# EAGLE design PCE_Joypad_Breakout-v3 (EAGLE 9.4.0)
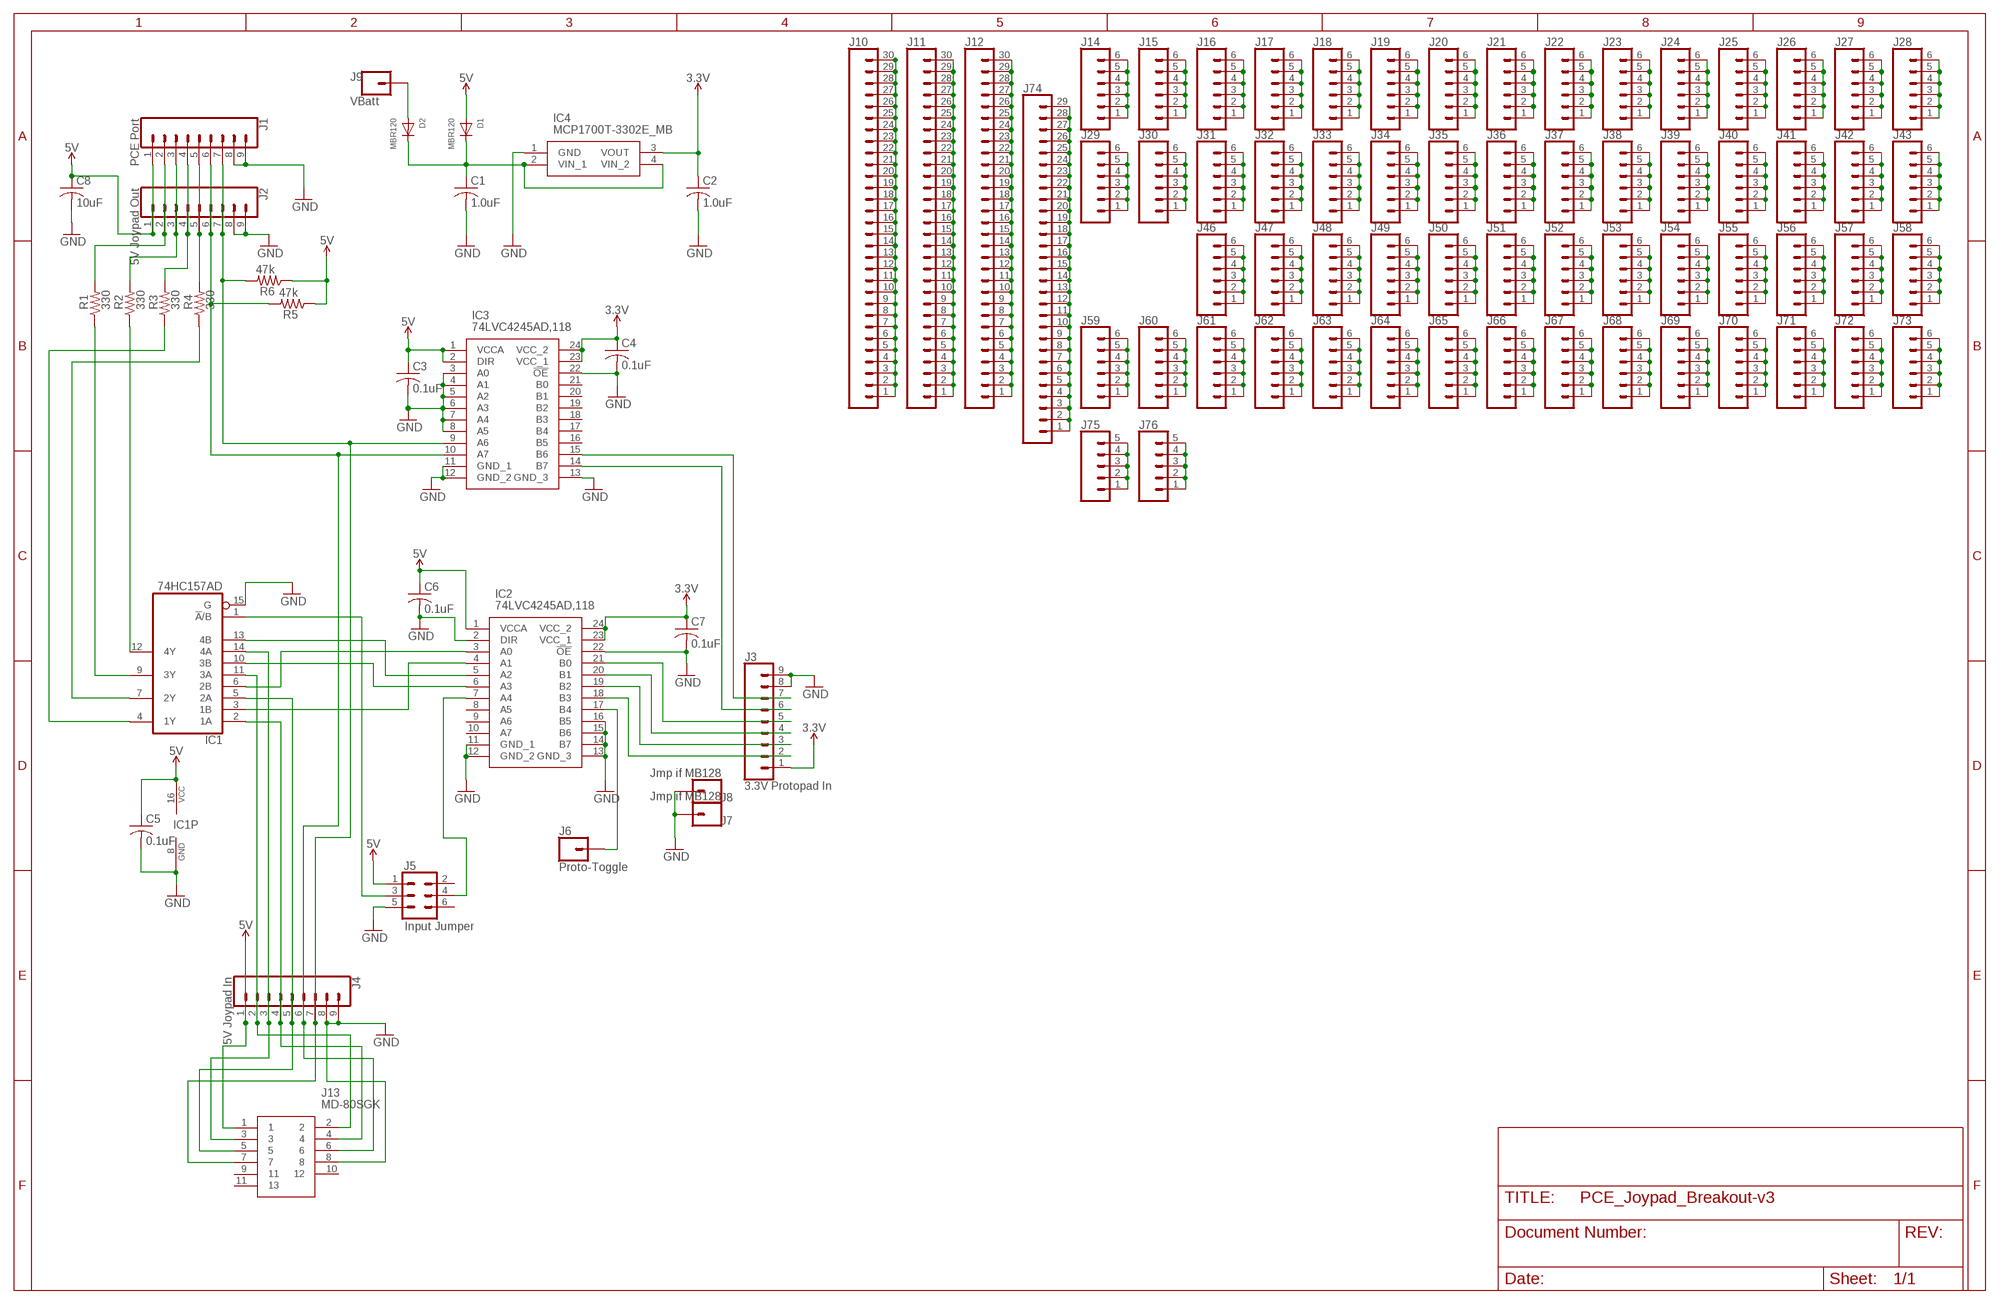
[diagram p0: schematic, sheet 1]

## Parts
C1  1.0uF  C-USC0805  [C0805]
C2  1.0uF  C-USC0805  [C0805]
C3  0.1uF  C-USC0805  [C0805]
C4  0.1uF  C-USC0805  [C0805]
C5  0.1uF  C-USC0805  [C0805]
C6  0.1uF  C-USC0805  [C0805]
C7  0.1uF  C-USC0805  [C0805]
C8  10uF  C-USC0805  [C0805]
D1  MBR120  DIODESOD-123  [SOD-123]
D2  MBR120  DIODESOD-123  [SOD-123]
IC1  74HC157AD  74157D  [SO16]
IC2  74LVC4245AD,118  [SOIC127P1032X265-24N]
IC3  74LVC4245AD,118  [SOIC127P1032X265-24N]
IC4  MCP1700T-3302E_MB  [MCP1700T-3302E/MB]
J1  PCE Port  CONN_09  [1X09]
J2  5V Joypad Out  CONN_09  [1X09]
J3  3.3V Protopad In  CONN_09  [1X09]
J4  5V Joypad In  CONN_09  [1X09]
J5  Input Jumper  CONN_03X2FEMALE  [2X3]
J6  Proto-Toggle  CONN_01  [1X01]
J7  Jmp if MB128  CONN_01  [1X01]
J8  Jmp if MB128  CONN_01  [1X01]
J9  VBatt  CONN_01  [1X01]
J10  CONN_30NO_SILK  [1X30_NO_SILK]
J11  CONN_30NO_SILK  [1X30_NO_SILK]
J12  CONN_30NO_SILK  [1X30_NO_SILK]
J13  MD-80SGK  [MD80SGK]
J14  CONN_06NO_SILK_FEMALE_PTH  [1X06_NO_SILK]
J15  CONN_06NO_SILK_FEMALE_PTH  [1X06_NO_SILK]
J16  CONN_06NO_SILK_FEMALE_PTH  [1X06_NO_SILK]
J17  CONN_06NO_SILK_FEMALE_PTH  [1X06_NO_SILK]
J18  CONN_06NO_SILK_FEMALE_PTH  [1X06_NO_SILK]
J19  CONN_06NO_SILK_FEMALE_PTH  [1X06_NO_SILK]
J20  CONN_06NO_SILK_FEMALE_PTH  [1X06_NO_SILK]
J21  CONN_06NO_SILK_FEMALE_PTH  [1X06_NO_SILK]
J22  CONN_06NO_SILK_FEMALE_PTH  [1X06_NO_SILK]
J23  CONN_06NO_SILK_FEMALE_PTH  [1X06_NO_SILK]
J24  CONN_06NO_SILK_FEMALE_PTH  [1X06_NO_SILK]
J25  CONN_06NO_SILK_FEMALE_PTH  [1X06_NO_SILK]
J26  CONN_06NO_SILK_FEMALE_PTH  [1X06_NO_SILK]
J27  CONN_06NO_SILK_FEMALE_PTH  [1X06_NO_SILK]
J28  CONN_06NO_SILK_FEMALE_PTH  [1X06_NO_SILK]
J29  CONN_06NO_SILK_FEMALE_PTH  [1X06_NO_SILK]
J30  CONN_06NO_SILK_FEMALE_PTH  [1X06_NO_SILK]
J31  CONN_06NO_SILK_FEMALE_PTH  [1X06_NO_SILK]
J32  CONN_06NO_SILK_FEMALE_PTH  [1X06_NO_SILK]
J33  CONN_06NO_SILK_FEMALE_PTH  [1X06_NO_SILK]
J34  CONN_06NO_SILK_FEMALE_PTH  [1X06_NO_SILK]
J35  CONN_06NO_SILK_FEMALE_PTH  [1X06_NO_SILK]
J36  CONN_06NO_SILK_FEMALE_PTH  [1X06_NO_SILK]
J37  CONN_06NO_SILK_FEMALE_PTH  [1X06_NO_SILK]
J38  CONN_06NO_SILK_FEMALE_PTH  [1X06_NO_SILK]
J39  CONN_06NO_SILK_FEMALE_PTH  [1X06_NO_SILK]
J40  CONN_06NO_SILK_FEMALE_PTH  [1X06_NO_SILK]
J41  CONN_06NO_SILK_FEMALE_PTH  [1X06_NO_SILK]
J42  CONN_06NO_SILK_FEMALE_PTH  [1X06_NO_SILK]
J43  CONN_06NO_SILK_FEMALE_PTH  [1X06_NO_SILK]
J46  CONN_06NO_SILK_FEMALE_PTH  [1X06_NO_SILK]
J47  CONN_06NO_SILK_FEMALE_PTH  [1X06_NO_SILK]
J48  CONN_06NO_SILK_FEMALE_PTH  [1X06_NO_SILK]
J49  CONN_06NO_SILK_FEMALE_PTH  [1X06_NO_SILK]
J50  CONN_06NO_SILK_FEMALE_PTH  [1X06_NO_SILK]
J51  CONN_06NO_SILK_FEMALE_PTH  [1X06_NO_SILK]
J52  CONN_06NO_SILK_FEMALE_PTH  [1X06_NO_SILK]
J53  CONN_06NO_SILK_FEMALE_PTH  [1X06_NO_SILK]
J54  CONN_06NO_SILK_FEMALE_PTH  [1X06_NO_SILK]
J55  CONN_06NO_SILK_FEMALE_PTH  [1X06_NO_SILK]
J56  CONN_06NO_SILK_FEMALE_PTH  [1X06_NO_SILK]
J57  CONN_06NO_SILK_FEMALE_PTH  [1X06_NO_SILK]
J58  CONN_06NO_SILK_FEMALE_PTH  [1X06_NO_SILK]
J59  CONN_06NO_SILK_FEMALE_PTH  [1X06_NO_SILK]
J60  CONN_06NO_SILK_FEMALE_PTH  [1X06_NO_SILK]
J61  CONN_06NO_SILK_FEMALE_PTH  [1X06_NO_SILK]
J62  CONN_06NO_SILK_FEMALE_PTH  [1X06_NO_SILK]
J63  CONN_06NO_SILK_FEMALE_PTH  [1X06_NO_SILK]
J64  CONN_06NO_SILK_FEMALE_PTH  [1X06_NO_SILK]
J65  CONN_06NO_SILK_FEMALE_PTH  [1X06_NO_SILK]
J66  CONN_06NO_SILK_FEMALE_PTH  [1X06_NO_SILK]
J67  CONN_06NO_SILK_FEMALE_PTH  [1X06_NO_SILK]
J68  CONN_06NO_SILK_FEMALE_PTH  [1X06_NO_SILK]
J69  CONN_06NO_SILK_FEMALE_PTH  [1X06_NO_SILK]
J70  CONN_06NO_SILK_FEMALE_PTH  [1X06_NO_SILK]
J71  CONN_06NO_SILK_FEMALE_PTH  [1X06_NO_SILK]
J72  CONN_06NO_SILK_FEMALE_PTH  [1X06_NO_SILK]
J73  CONN_06NO_SILK_FEMALE_PTH  [1X06_NO_SILK]
J74  CONN_29NO_SILK  [1X29_NO_SILK]
J75  CONN_05NO_SILK  [1X05_NO_SILK]
J76  CONN_05NO_SILK  [1X05_NO_SILK]
R1  330  R-US_R0805  [R0805]
R2  330  R-US_R0805  [R0805]
R3  330  R-US_R0805  [R0805]
R4  330  R-US_R0805  [R0805]
R5  47k  R-US_R0805  [R0805]
R6  47k  R-US_R0805  [R0805]

## Nets
3.3V [Power]: C2.1 C4.1 C7.1 IC2.23(VCC_1) IC2.24(VCC_2) IC3.23(VCC_1) IC3.24(VCC_2) IC4.3(VOUT) J3.1
5V [Power]: C3.1 C5.1 C6.1 C8.1 D1.A IC1.16(VCC) IC2.1(VCCA) IC3.1(VCCA) IC3.2(DIR) J1.1 J2.1 J4.1 J5.1 J13.1 R5.1 R6.1
GND [Power]: C1.2 C2.2 C3.2 C4.2 C5.2 C6.2 C7.2 C8.2 IC1.8(GND) IC1.15(G) IC2.2(DIR) IC2.11(GND_1) IC2.12(GND_2) IC2.13(GND_3) IC2.14(B7) IC2.15(B6) IC2.16(B5) IC2.22(!OE) IC3.3(A0) IC3.4(A1) IC3.5(A2) IC3.6(A3) IC3.7(A4) IC3.8(A5) IC3.11(GND_1) IC3.12(GND_2) IC3.13(GND_3) IC3.22(!OE) IC4.1(GND) J1.8 J1.9 J2.8 J2.9 J3.8 J3.9 J4.8 J4.9 J5.5 J7.1 J8.1 J13.8
N$1: J1.4 J2.4 R3.2
N$3 [Power]: C1.1 D1.C D2.C IC4.2(VIN_1) IC4.4(VIN_2)
N$4: J1.2 J2.2 R1.2
N$5: J1.3 J2.3 R2.2
N$6: IC1.11(3A) J4.2 J13.2
N$7: J1.5 J2.5 R4.2
N$8: IC1.9(3Y) R1.1
N$9: IC3.9(A6) J1.7 J2.7 J4.7 J13.7 R6.2
N$10: IC1.14(4A) J4.3 J13.3
N$11: IC1.2(1A) J4.4 J13.4
N$12: IC1.5(2A) J4.5 J13.5
N$13: IC3.14(B7) J3.6
N$14: IC3.15(B6) J3.7
N$15: IC1.6(2B) IC2.3(A0)
N$16: IC1.13(4B) IC2.5(A2)
N$17: IC1.10(3B) IC2.6(A3)
N$18: IC3.10(A7) J1.6 J2.6 J4.6 J13.6 R5.2
N$19: IC1.3(1B) IC2.4(A1)
N$20: IC1.4(1Y) R3.1
N$21: IC1.7(2Y) R4.1
N$22: IC2.21(B0) J3.5
N$23: IC2.20(B1) J3.4
N$24: IC2.19(B2) J3.3
N$25: IC1.1(!A!/B) J5.3
N$27: IC2.7(A4) J5.4
N$28 [Power]: D2.A J9.1
N$29: IC2.17(B4) J6.1
N$30 [Breadboard]: J10.1 J10.2 J10.3 J10.4 J10.5 J10.6 J10.7 J10.8 J10.9 J10.10 J10.11 J10.12 J10.13 J10.14 J10.15 J10.16 J10.17 J10.18 J10.19 J10.20 J10.21 J10.22 J10.23 J10.24 J10.25 J10.26 J10.27 J10.28 J10.29 J10.30
N$31 [Breadboard]: J11.1 J11.2 J11.3 J11.4 J11.5 J11.6 J11.7 J11.8 J11.9 J11.10 J11.11 J11.12 J11.13 J11.14 J11.15 J11.16 J11.17 J11.18 J11.19 J11.20 J11.21 J11.22 J11.23 J11.24 J11.25 J11.26 J11.27 J11.28 J11.29 J11.30
N$32 [Breadboard]: J12.1 J12.2 J12.3 J12.4 J12.5 J12.6 J12.7 J12.8 J12.9 J12.10 J12.11 J12.12 J12.13 J12.14 J12.15 J12.16 J12.17 J12.18 J12.19 J12.20 J12.21 J12.22 J12.23 J12.24 J12.25 J12.26 J12.27 J12.28 J12.29 J12.30
N$33: IC1.12(4Y) R2.1
N$34 [Breadboard]: J14.1 J14.2 J14.3 J14.4 J14.5 J14.6
N$35 [Breadboard]: J29.1 J29.2 J29.3 J29.4 J29.5 J29.6
N$36 [Breadboard]: J15.1 J15.2 J15.3 J15.4 J15.5 J15.6
N$37 [Breadboard]: J30.1 J30.2 J30.3 J30.4 J30.5 J30.6
N$38 [Breadboard]: J31.1 J31.2 J31.3 J31.4 J31.5 J31.6
N$39 [Breadboard]: J16.1 J16.2 J16.3 J16.4 J16.5 J16.6
N$40 [Breadboard]: J17.1 J17.2 J17.3 J17.4 J17.5 J17.6
N$41 [Breadboard]: J32.1 J32.2 J32.3 J32.4 J32.5 J32.6
N$42 [Breadboard]: J33.1 J33.2 J33.3 J33.4 J33.5 J33.6
N$43 [Breadboard]: J18.1 J18.2 J18.3 J18.4 J18.5 J18.6
N$44 [Breadboard]: J19.1 J19.2 J19.3 J19.4 J19.5 J19.6
N$45 [Breadboard]: J20.1 J20.2 J20.3 J20.4 J20.5 J20.6
N$46 [Breadboard]: J21.1 J21.2 J21.3 J21.4 J21.5 J21.6
N$47 [Breadboard]: J22.1 J22.2 J22.3 J22.4 J22.5 J22.6
N$48 [Breadboard]: J23.1 J23.2 J23.3 J23.4 J23.5 J23.6
N$49 [Breadboard]: J24.1 J24.2 J24.3 J24.4 J24.5 J24.6
N$50 [Breadboard]: J25.1 J25.2 J25.3 J25.4 J25.5 J25.6
N$51 [Breadboard]: J26.1 J26.2 J26.3 J26.4 J26.5 J26.6
N$52 [Breadboard]: J27.1 J27.2 J27.3 J27.4 J27.5 J27.6
N$53 [Breadboard]: J28.1 J28.2 J28.3 J28.4 J28.5 J28.6
N$54 [Breadboard]: J34.1 J34.2 J34.3 J34.4 J34.5 J34.6
N$55 [Breadboard]: J35.1 J35.2 J35.3 J35.4 J35.5 J35.6
N$56 [Breadboard]: J36.1 J36.2 J36.3 J36.4 J36.5 J36.6
N$57 [Breadboard]: J37.1 J37.2 J37.3 J37.4 J37.5 J37.6
N$58 [Breadboard]: J38.1 J38.2 J38.3 J38.4 J38.5 J38.6
N$59 [Breadboard]: J39.1 J39.2 J39.3 J39.4 J39.5 J39.6
N$60 [Breadboard]: J40.1 J40.2 J40.3 J40.4 J40.5 J40.6
N$61 [Breadboard]: J41.1 J41.2 J41.3 J41.4 J41.5 J41.6
N$62 [Breadboard]: J42.1 J42.2 J42.3 J42.4 J42.5 J42.6
N$63 [Breadboard]: J43.1 J43.2 J43.3 J43.4 J43.5 J43.6
N$64 [Breadboard]: J75.1 J75.2 J75.3 J75.4 J75.5
N$65 [Breadboard]: J76.1 J76.2 J76.3 J76.4 J76.5
N$66 [Breadboard]: J46.1 J46.2 J46.3 J46.4 J46.5 J46.6
N$67 [Breadboard]: J47.1 J47.2 J47.3 J47.4 J47.5 J47.6
N$68 [Breadboard]: J48.1 J48.2 J48.3 J48.4 J48.5 J48.6
N$69 [Breadboard]: J49.1 J49.2 J49.3 J49.4 J49.5 J49.6
N$70 [Breadboard]: J50.1 J50.2 J50.3 J50.4 J50.5 J50.6
N$71 [Breadboard]: J51.1 J51.2 J51.3 J51.4 J51.5 J51.6
N$72 [Breadboard]: J52.1 J52.2 J52.3 J52.4 J52.5 J52.6
N$73 [Breadboard]: J53.1 J53.2 J53.3 J53.4 J53.5 J53.6
N$74 [Breadboard]: J54.1 J54.2 J54.3 J54.4 J54.5 J54.6
N$75 [Breadboard]: J55.1 J55.2 J55.3 J55.4 J55.5 J55.6
N$76 [Breadboard]: J56.1 J56.2 J56.3 J56.4 J56.5 J56.6
N$77 [Breadboard]: J57.1 J57.2 J57.3 J57.4 J57.5 J57.6
N$78 [Breadboard]: J58.1 J58.2 J58.3 J58.4 J58.5 J58.6
N$79 [Breadboard]: J59.1 J59.2 J59.3 J59.4 J59.5 J59.6
N$80 [Breadboard]: J60.1 J60.2 J60.3 J60.4 J60.5 J60.6
N$81 [Breadboard]: J61.1 J61.2 J61.3 J61.4 J61.5 J61.6
N$82 [Breadboard]: J62.1 J62.2 J62.3 J62.4 J62.5 J62.6
N$83 [Breadboard]: J63.1 J63.2 J63.3 J63.4 J63.5 J63.6
N$84 [Breadboard]: J64.1 J64.2 J64.3 J64.4 J64.5 J64.6
N$85 [Breadboard]: J65.1 J65.2 J65.3 J65.4 J65.5 J65.6
N$86 [Breadboard]: J66.1 J66.2 J66.3 J66.4 J66.5 J66.6
N$87 [Breadboard]: J67.1 J67.2 J67.3 J67.4 J67.5 J67.6
N$88 [Breadboard]: J68.1 J68.2 J68.3 J68.4 J68.5 J68.6
N$89 [Breadboard]: J69.1 J69.2 J69.3 J69.4 J69.5 J69.6
N$90 [Breadboard]: J70.1 J70.2 J70.3 J70.4 J70.5 J70.6
N$91 [Breadboard]: J71.1 J71.2 J71.3 J71.4 J71.5 J71.6
N$92 [Breadboard]: J72.1 J72.2 J72.3 J72.4 J72.5 J72.6
N$93 [Breadboard]: J73.1 J73.2 J73.3 J73.4 J73.5 J73.6
N$94 [Breadboard]: J74.1 J74.2 J74.3 J74.4 J74.5 J74.6 J74.7 J74.8 J74.9 J74.10 J74.11 J74.12 J74.13 J74.14 J74.15 J74.16 J74.17 J74.18 J74.19 J74.20 J74.21 J74.22 J74.23 J74.24 J74.25 J74.26 J74.27 J74.28 J74.29
N$97: IC2.18(B3) J3.2
Unconnected: IC2.8(A5) IC2.9(A6) IC2.10(A7) IC3.16(B5) IC3.17(B4) IC3.18(B3) IC3.19(B2) IC3.20(B1) IC3.21(B0) J5.2 J5.6 J13.9 J13.10 J13.11

## Library data of the parts
C1-C8 = resistor:C-US: CAPACITOR, American symbol
D1 D2 = adafruit:DIODE: Diode SMADIODE - SMA Surface Mount Package 20V 1A Schottky Diode Digikey: 641-1014-6-ND DO-1N4148 - Through Hole Small Current Diode SOD-123 20V 1 A (.5mV Vf) Schottky Diode - Digikey: MBRX120TPMSCT-ND SOD-323 10V 570mA (.38mV Vf, 3ns) Schottky Diode - Digikey: ZLLS410CT-ND SOD-523 30V 30mA Schottky Diode (RB751S-40TE61) - Digikey: RB751S-40TE61CT-ND SOT23-R/W - SOT23 Package (R = Solder Paste/Reflow Ovens, W = Hand-Soldering) BAT54Film 40V 300mA - Digikey: 497-7162-1-ND
IC1 = 74xx-us:74*157: Quadruple 2-line to 1-line data SELECTOR/MULTIPLEXER
IC2 IC3 = SamacSys_Parts:74LVC4245AD,118: NEXPERIA - 74LVC4245AD,118 - TRANSCEIVER, NON-INVERTING, SOIC-24 Source: Datasheet <https://assets.nexperia.com/documents/data-sheet/74LVC4245A.pdf>; DESCRIPTION: NEXPERIA - 74LVC4245AD,118 - TRANSCEIVER, NON-INVERTING, SOIC-24; HEIGHT: 2.65mm; MANUFACTURER_NAME: Nexperia; MANUFACTURER_PART_NUMBER: 74LVC4245AD,118; MOUSER_PART_NUMBER: 771-74LVC4245AD-T; MOUSER_PRICE-STOCK: https://www.mouser.com/Search/Refine.aspx?Keyword=771-74LVC4245AD-T; RS_PART_NUMBER: 1708039; RS_PRICE-STOCK: http://uk.rs-online.com/web/p/products/1708039
IC4 = SamacSys_Parts:MCP1700T-3302E_MB: LDO voltage regulator 250mA Isupply 1uA Source: Datasheet <http://ww1.microchip.com/downloads/en/DeviceDoc/20001826C.pdf>; ALLIED_NUMBER: 70045392; ALLIED_PRICE-STOCK: http://www.alliedelec.com/microchip-technology-inc-mcp1700t-3302e-mb/70045392/; DESCRIPTION: LDO voltage regulator 250mA Isupply 1uA; HEIGHT: mm; MANUFACTURER_NAME: Microchip; MANUFACTURER_PART_NUMBER: MCP1700T-3302E/MB; MOUSER_PART_NUMBER: 579-MCP1700T3302E/MB; MOUSER_PRICE-STOCK: https://www.mouser.com/Search/Refine.aspx?Keyword=579-MCP1700T3302E%2FMB; RS_PART_NUMBER: 9115561; RS_PRICE-STOCK: http://uk.rs-online.com/web/p/products/9115561
J1-J4 = SparkFun-Connectors:CONN_09: Multi connection point. Often used as Generic Header-pin footprint for 0.1 inch spaced/style header connections On any of the 0.1 inch spaced packages, you can populate with these: Break Away Headers - Straight <https://www.sparkfun.com/products/116> (PRT-00116) Break Away Male Headers - Right Angle <https://www.sparkfun.com/products/553> (PRT-00553) Female Headers <https://www.sparkfun.com/products/115> (PRT-00115) Break Away Headers - Machine Pin <https://www.sparkfun.com/products/117> (PRT-00117) Break Away Female Headers - Swiss Machine Pin <https://www.sparkfun.com/products/743> (PRT-00743) For SCREWTERMINALS and SPRING TERMINALS visit here: Screw Terimnals on SparkFun.com <https://www.sparkfun.com/search/results?term=Screw+Terminals> (5mm/3.5mm/2.54mm spacing) This device is also useful as a general connection point to wire up your design to another part of your project. Our various solder wires solder well into these plated through hole pads. Hook-Up Wire - Assortment (Stranded, 22 AWG) <https://www.sparkfun.com/products/11375> (PRT-11375) Hook-Up Wire - Assortment (Solid Core, 22 AWG) <https://www.sparkfun.com/products/11367> (PRT-11367) View the entire wire category on our website here <https://www.sparkfun.com/categories/141> Special notes: Molex polarized connector foot print use with SKU : PRT-08231 with associated crimp pins and housings. 1MM SMD Version SKU: PRT-10208 NOTES ON THE VARIANTS LOCK and LOCK_LONGPADS... This footprint was designed to help hold the alignment of a through-hole component (i.e. 6-pin header) while soldering it into place. You may notice that each hole has been shifted either up or down by 0.005 of an inch from it's more standard position (which is a perfectly straight line). This slight alteration caused the pins (the squares in the middle) to touch the edges of the holes. Because they are alternating, it causes a "brace" to hold the component in place. 0.005 has proven to be the perfect amount of "off-center" position when using our standard breakaway headers. Although looks a little odd when you look at the bare footprint, once you have a header in there, the alteration is very hard to notice. Also,if you push a header all the way into place, it is covered up entirely on the bottom side.
J5 = SparkFun-Connectors:CONN_03X2: Multi connection point. Often used as Generic Header-pin footprint for 0.1 inch spaced/style header connections You can populate with any combo of single row headers, but if you'd like an exact match, check these: Header - 2x3 (Male, 0.1") <https://www.sparkfun.com/products/12807> (PRT-12807) Header - 2x3 (Female, 0.1") <https://www.sparkfun.com/products/13010> (PRT-13010) 2x3 Pin Shrouded Header <https://www.sparkfun.com/products/10877> (PRT-10877) On any of the 0.1 inch spaced packages, you can populate with these: Break Away Headers - Straight <https://www.sparkfun.com/products/116> (PRT-00116) Break Away Male Headers - Right Angle <https://www.sparkfun.com/products/553> (PRT-00553) Female Headers <https://www.sparkfun.com/products/115> (PRT-00115) Break Away Headers - Machine Pin <https://www.sparkfun.com/products/117> (PRT-00117) Break Away Female Headers - Swiss Machine Pin <https://www.sparkfun.com/products/743> (PRT-00743) Special note: the shrouded connector mates well with our 3x2 ribbon cables: Ribbon Crimp Connector - 6-pin (2x3, Female) <https://www.sparkfun.com/products/10651> (PRT-10651) Ribbon Cable - 6 wire (15ft) <https://www.sparkfun.com/products/10646> (PRT-10646); PROD_ID: CONN-11566; VALUE: FEMALE 2x3
J6-J9 = SparkFun-Connectors:CONN_01: Single connection point. Often used as Generic Header-pin footprint for 0.1 inch spaced/style header connections On any of the 0.1 inch spaced packages, you can populate with these: Break Away Headers - Straight <https://www.sparkfun.com/products/116> (PRT-00116) Break Away Male Headers - Right Angle <https://www.sparkfun.com/products/553> (PRT-00553) Female Headers <https://www.sparkfun.com/products/115> (PRT-00115) Break Away Headers - Machine Pin <https://www.sparkfun.com/products/117> (PRT-00117) Break Away Female Headers - Swiss Machine Pin <https://www.sparkfun.com/products/743> (PRT-00743) This device is also useful as a general connection point to wire up your design to another part of your project. Our various solder wires solder well into these plated through hole pads. Hook-Up Wire - Assortment (Stranded, 22 AWG) <https://www.sparkfun.com/products/11375> (PRT-11375) Hook-Up Wire - Assortment (Solid Core, 22 AWG) <https://www.sparkfun.com/products/11367> (PRT-11367) View the entire wire category on our website here <https://www.sparkfun.com/categories/141> Special notes: SMTSO-256-ET is a "flush mount" nut for a 4-40 screw. We mostly use this on specialty testbeds; it is a nice way to connect hardware to your PCB at an adjustable hieght. Also note, the SNAP packages are for using a snappable style connector. We sell a baggie of snaps and they are also used on two LilyPad designs: Snap Assortment - 30 pack (male and female) <https://www.sparkfun.com/products/11347> (DEV-11347) LilyPad Arduino SimpleSnap <https://www.sparkfun.com/products/10941> (DEV-10941) LilyPad SimpleSnap Protoboard <https://www.sparkfun.com/products/10940> (DEV-10940)
J10-J12 = SparkFun-Connectors:CONN_30: Multi connection point. Often used as Generic Header-pin footprint for 0.1 inch spaced/style header connections On any of the 0.1 inch spaced packages, you can populate with these: Break Away Headers - Straight <https://www.sparkfun.com/products/116> (PRT-00116) Break Away Male Headers - Right Angle <https://www.sparkfun.com/products/553> (PRT-00553) Female Headers <https://www.sparkfun.com/products/115> (PRT-00115) Break Away Headers - Machine Pin <https://www.sparkfun.com/products/117> (PRT-00117) Break Away Female Headers - Swiss Machine Pin <https://www.sparkfun.com/products/743> (PRT-00743) For SCREWTERMINALS and SPRING TERMINALS visit here: Screw Terimnals on SparkFun.com <https://www.sparkfun.com/search/results?term=Screw+Terminals> (5mm/3.5mm/2.54mm spacing) This device is also useful as a general connection point to wire up your design to another part of your project. Our various solder wires solder well into these plated through hole pads. Hook-Up Wire - Assortment (Stranded, 22 AWG) <https://www.sparkfun.com/products/11375> (PRT-11375) Hook-Up Wire - Assortment (Solid Core, 22 AWG) <https://www.sparkfun.com/products/11367> (PRT-11367) View the entire wire category on our website here <https://www.sparkfun.com/categories/141> Special notes: Molex polarized connector foot print use with SKU : PRT-08231 with associated crimp pins and housings. 1MM SMD Version SKU: PRT-10208 NOTES ON THE VARIANTS LOCK and LOCK_LONGPADS... This footprint was designed to help hold the alignment of a through-hole component (i.e. 6-pin header) while soldering it into place. You may notice that each hole has been shifted either up or down by 0.005 of an inch from it's more standard position (which is a perfectly straight line). This slight alteration caused the pins (the squares in the middle) to touch the edges of the holes. Because they are alternating, it causes a "brace" to hold the component in place. 0.005 has proven to be the perfect amount of "off-center" position when using our standard breakaway headers. Although looks a little odd when you look at the bare footprint, once you have a header in there, the alteration is very hard to notice. Also,if you push a header all the way into place, it is covered up entirely on the bottom side.
J13 = SamacSys_Parts:MD-80SGK: Circular DIN Connectors mini-DIN, 8P jack, rt, through hole, full shield Source: Datasheet <https://www.cui.com/product/resource/md-sgk-series.pdf>; DESCRIPTION: Circular DIN Connectors mini-DIN, 8P jack, rt, through hole, full shield; HEIGHT: 13mm; MANUFACTURER_NAME: CUI; MANUFACTURER_PART_NUMBER: MD-80SGK; MOUSER_PART_NUMBER: 490-MD-80SGK; MOUSER_PRICE-STOCK: https://www.mouser.com/Search/Refine.aspx?Keyword=490-MD-80SGK
J14-J43 J46-J73 = SparkFun-Connectors:CONN_06: Multi connection point. Often used as Generic Header-pin footprint for 0.1 inch spaced/style header connections On any of the 0.1 inch spaced packages, you can populate with these: Break Away Headers - Straight <https://www.sparkfun.com/products/116> (PRT-00116) Break Away Male Headers - Right Angle <https://www.sparkfun.com/products/553> (PRT-00553) Female Headers <https://www.sparkfun.com/products/115> (PRT-00115) Break Away Headers - Machine Pin <https://www.sparkfun.com/products/117> (PRT-00117) Break Away Female Headers - Swiss Machine Pin <https://www.sparkfun.com/products/743> (PRT-00743) Arduino Stackable Header - 6 Pin <https://www.sparkfun.com/products/9280> (PRT-09280) For SCREWTERMINALS and SPRING TERMINALS visit here: Screw Terimnals on SparkFun.com <https://www.sparkfun.com/search/results?term=Screw+Terminals> (5mm/3.5mm/2.54mm spacing) This device is also useful as a general connection point to wire up your design to another part of your project. Our various solder wires solder well into these plated through hole pads. Hook-Up Wire - Assortment (Stranded, 22 AWG) <https://www.sparkfun.com/products/11375> (PRT-11375) Hook-Up Wire - Assortment (Solid Core, 22 AWG) <https://www.sparkfun.com/products/11367> (PRT-11367) View the entire wire category on our website here <https://www.sparkfun.com/categories/141>; PROD_ID: CONN-08437
J74 = SparkFun-Connectors:CONN_29: Multi connection point. Often used as Generic Header-pin footprint for 0.1 inch spaced/style header connections On any of the 0.1 inch spaced packages, you can populate with these: Break Away Headers - Straight <https://www.sparkfun.com/products/116> (PRT-00116) Break Away Male Headers - Right Angle <https://www.sparkfun.com/products/553> (PRT-00553) Female Headers <https://www.sparkfun.com/products/115> (PRT-00115) Break Away Headers - Machine Pin <https://www.sparkfun.com/products/117> (PRT-00117) Break Away Female Headers - Swiss Machine Pin <https://www.sparkfun.com/products/743> (PRT-00743) For SCREWTERMINALS and SPRING TERMINALS visit here: Screw Terimnals on SparkFun.com <https://www.sparkfun.com/search/results?term=Screw+Terminals> (5mm/3.5mm/2.54mm spacing) This device is also useful as a general connection point to wire up your design to another part of your project. Our various solder wires solder well into these plated through hole pads. Hook-Up Wire - Assortment (Stranded, 22 AWG) <https://www.sparkfun.com/products/11375> (PRT-11375) Hook-Up Wire - Assortment (Solid Core, 22 AWG) <https://www.sparkfun.com/products/11367> (PRT-11367) View the entire wire category on our website here <https://www.sparkfun.com/categories/141> Special notes: Molex polarized connector foot print use with SKU : PRT-08231 with associated crimp pins and housings. 1MM SMD Version SKU: PRT-10208 NOTES ON THE VARIANTS LOCK and LOCK_LONGPADS... This footprint was designed to help hold the alignment of a through-hole component (i.e. 6-pin header) while soldering it into place. You may notice that each hole has been shifted either up or down by 0.005 of an inch from it's more standard position (which is a perfectly straight line). This slight alteration caused the pins (the squares in the middle) to touch the edges of the holes. Because they are alternating, it causes a "brace" to hold the component in place. 0.005 has proven to be the perfect amount of "off-center" position when using our standard breakaway headers. Although looks a little odd when you look at the bare footprint, once you have a header in there, the alteration is very hard to notice. Also,if you push a header all the way into place, it is covered up entirely on the bottom side.
J75 J76 = SparkFun-Connectors:CONN_05: Multi connection point. Often used as Generic Header-pin footprint for 0.1 inch spaced/style header connections On any of the 0.1 inch spaced packages, you can populate with these: Break Away Headers - Straight <https://www.sparkfun.com/products/116> (PRT-00116) Break Away Male Headers - Right Angle <https://www.sparkfun.com/products/553> (PRT-00553) Female Headers <https://www.sparkfun.com/products/115> (PRT-00115) Break Away Headers - Machine Pin <https://www.sparkfun.com/products/117> (PRT-00117) Break Away Female Headers - Swiss Machine Pin <https://www.sparkfun.com/products/743> (PRT-00743) For SCREWTERMINALS and SPRING TERMINALS visit here: Screw Terimnals on SparkFun.com <https://www.sparkfun.com/search/results?term=Screw+Terminals> (5mm/3.5mm/2.54mm spacing) This device is also useful as a general connection point to wire up your design to another part of your project. Our various solder wires solder well into these plated through hole pads. Hook-Up Wire - Assortment (Stranded, 22 AWG) <https://www.sparkfun.com/products/11375> (PRT-11375) Hook-Up Wire - Assortment (Solid Core, 22 AWG) <https://www.sparkfun.com/products/11367> (PRT-11367) View the entire wire category on our website here <https://www.sparkfun.com/categories/141> Special notes: Molex polarized connector foot print use with SKU : PRT-08231 with associated crimp pins and housings. 1MM SMD Version SKU: PRT-10208
R1-R6 = resistor:R-US_: RESISTOR, American symbol

## Net classes
0 default: width 0.203 mm, drill 0.33 mm, clearance 0.205 mm
1 Power: width 0.305 mm, drill 0.33 mm, clearance 0.205 mm to class 0, clearance 0.205 mm
2 Breadboard: width 0.762 mm, clearance 0.205 mm to class 0, clearance 0.205 mm to class 1, clearance 0.205 mm

## Board
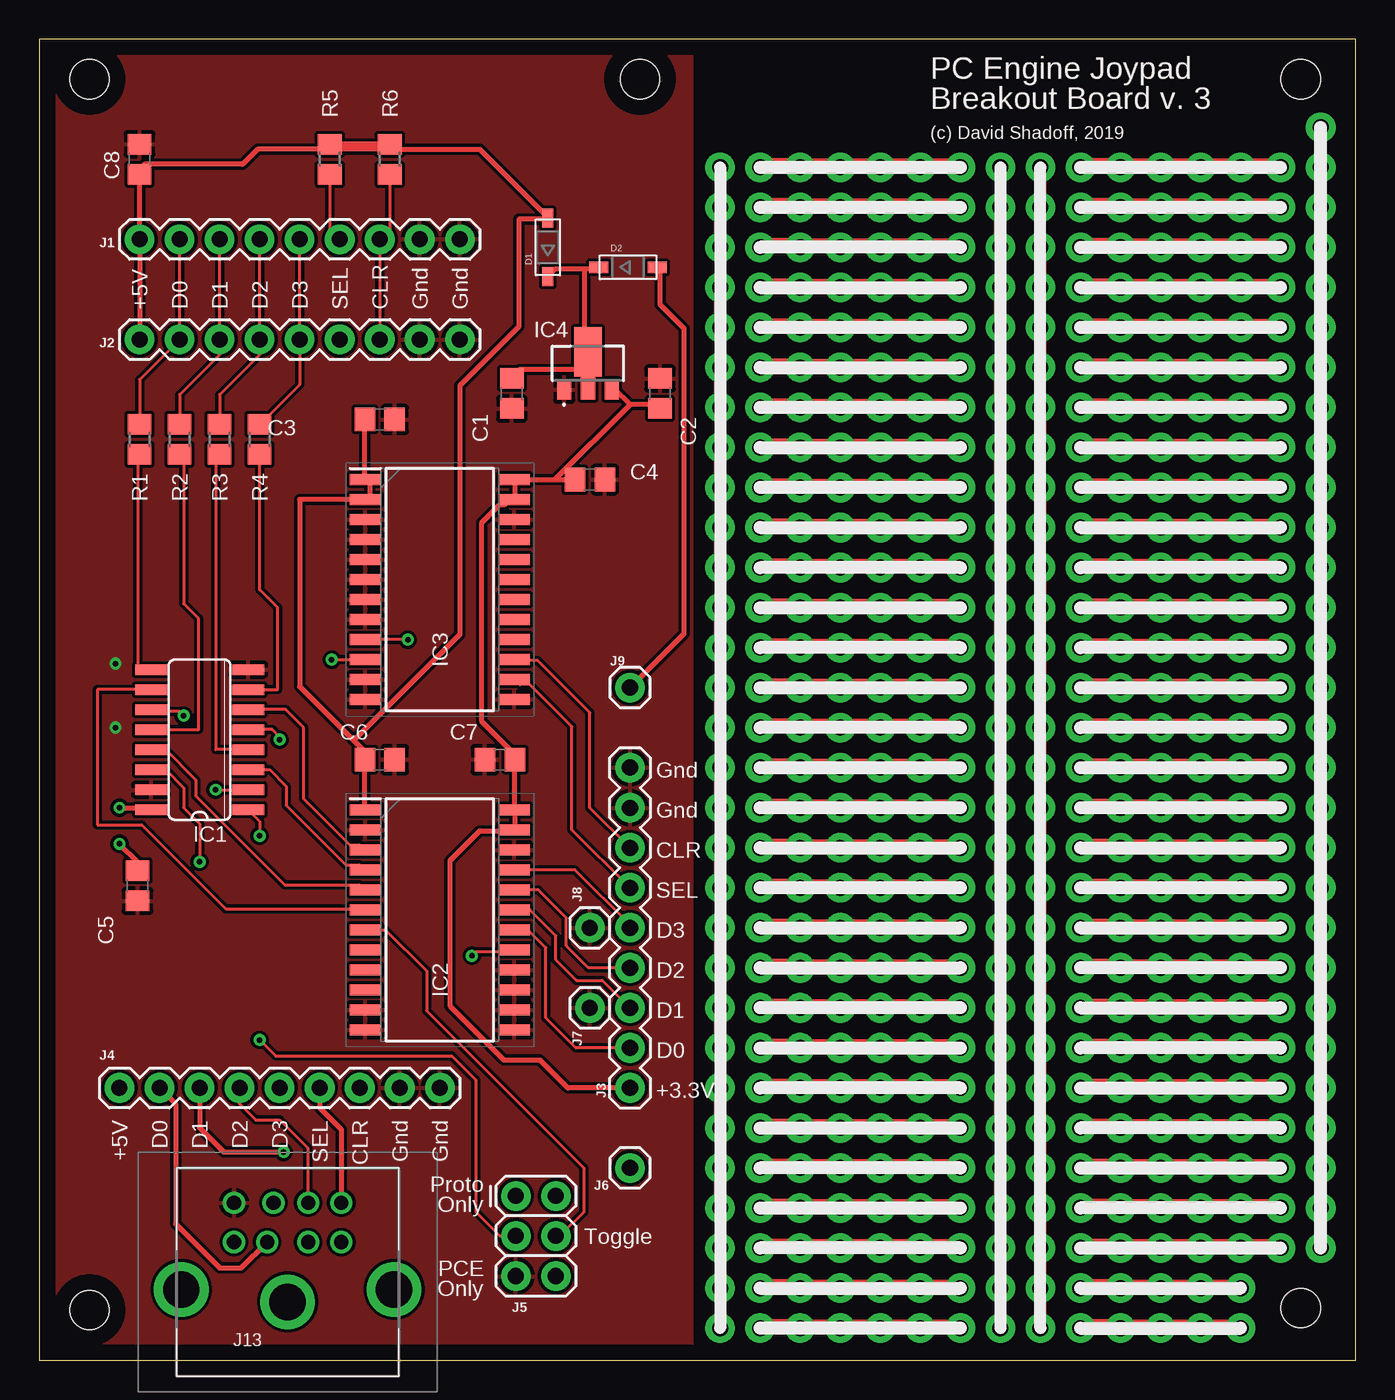
[diagram p1: board, top side]
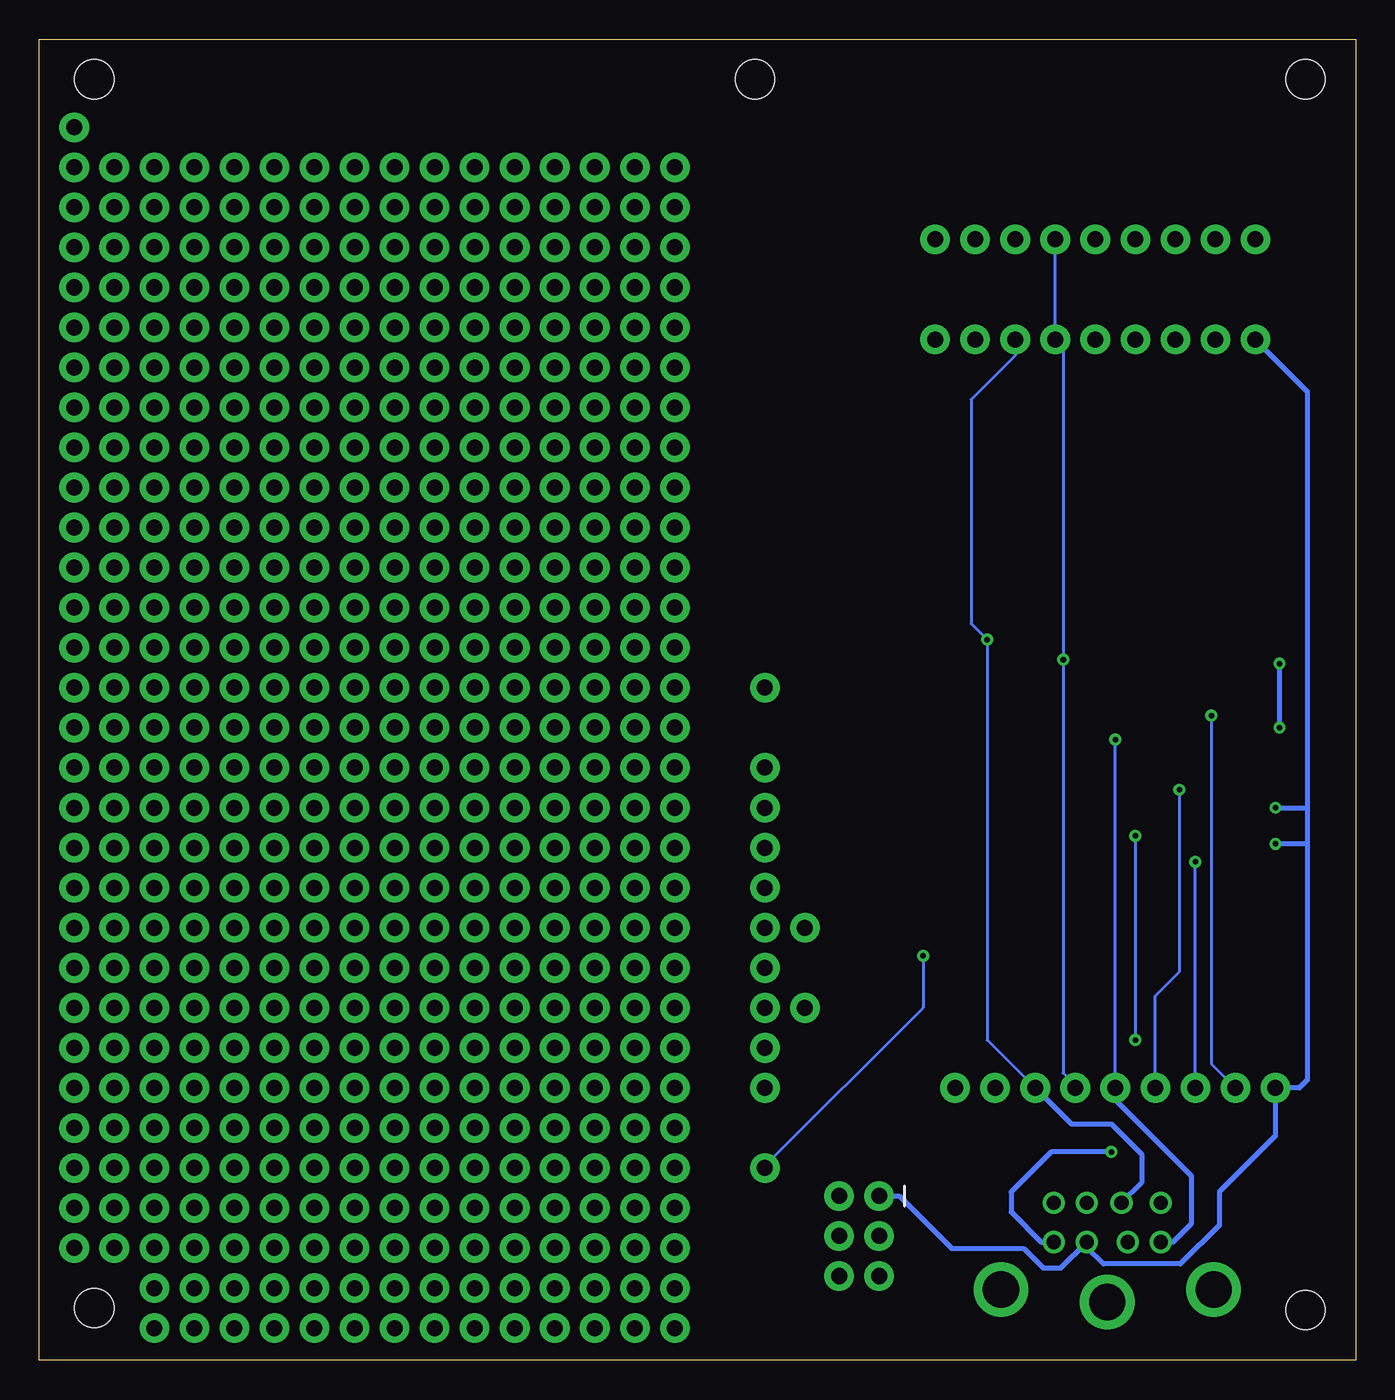
[diagram p2: board, bottom side, seen from below]

Size 83.49 x 83.81 mm. Coordinates in mm from the lower left corner, seen from the top.
Outline: 0,0 83.49,0 83.49,83.81 0,83.81 0,0
Copper layers (1*16): Top 0.035mm / dielectric 1.5mm / Bottom 0.035mm
Design rules "default": minimum track width 6mil, minimum drill 0.35mm, track to track 6mil, track to pad 6mil, pad to pad 6mil, via to via 6mil, smd to smd 6mil, copper to edge 40mil, drill to drill 6mil, minimum pad ring 10mil, minimum via ring 8mil, stop-mask expansion 4mil, vias tented up to drill 0mil, thermal gap 10mil
Holes 2.49 mm at 80.01,3.3 3.17,3.17 3.17,81.28 80.01,81.28 38.1,81.28

### Footprints (pad centres in the part's own frame; a part is rotated, then mirrored left to right if it is on the bottom)
C0805 = smd 1.3 x 1.5: 1 -0.95,0; 2 0.95,0
SOD-123 = smd 1.2 x 0.7: A 1.85,0; C -1.85,0
SO16 = smd 0.66 x 2.032: 1 -4.445,-3.073; 2 -3.175,-3.073; 3 -1.905,-3.073; 4 -0.635,-3.073; 5 0.635,-3.073; 6 1.905,-3.073; 7 3.175,-3.073; 8 4.445,-3.073; 9 4.445,3.073; 10 3.175,3.073; 11 1.905,3.073; 12 0.635,3.073; 13 -0.635,3.073; 14 -1.905,3.073; 15 -3.175,3.073; 16 -4.445,3.073
SOIC127P1032X265-24N = smd 1.95 x 0.7: 1 -4.725,6.985; 2 -4.725,5.715; 3 -4.725,4.445; 4 -4.725,3.175; 5 -4.725,1.905; 6 -4.725,0.635; 7 -4.725,-0.635; 8 -4.725,-1.905; 9 -4.725,-3.175; 10 -4.725,-4.445; 11 -4.725,-5.715; 12 -4.725,-6.985; 13 4.725,-6.985; 14 4.725,-5.715; 15 4.725,-4.445; 16 4.725,-3.175; 17 4.725,-1.905; 18 4.725,-0.635; 19 4.725,0.635; 20 4.725,1.905; 21 4.725,3.175; 22 4.725,4.445; 23 4.725,5.715; 24 4.725,6.985
MCP1700T-3302E/MB = smd 0.9 x 1.3: 1 -1.5,-1.65; 3 1.5,-1.65 | smd 0.9 x 1.475: 2 0,-1.562 | smd 1.733 x 3.125: 4 0,0.738
1X09 = drill 1.016 pad 1.88: 1 0,0; 2 2.54,0; 3 5.08,0; 4 7.62,0; 5 10.16,0; 6 12.7,0; 7 15.24,0; 8 17.78,0; 9 20.32,0
2X3 = drill 1.016 pad 1.88: 1 0,0; 2 0,2.54; 3 2.54,0; 4 2.54,2.54; 5 5.08,0; 6 5.08,2.54
1X01 = drill 1.016 pad 1.88: 1 0,0
1X30_NO_SILK = drill 1.016 pad 1.88: 1 0,0; 2 2.54,0; 3 5.08,0; 4 7.62,0; 5 10.16,0; 6 12.7,0; 7 15.24,0; 8 17.78,0; 9 20.32,0; 10 22.86,0; 11 25.4,0; 12 27.94,0; 13 30.48,0; 14 33.02,0; 15 35.56,0; 16 38.1,0; 17 40.64,0; 18 43.18,0; 19 45.72,0; 20 48.26,0; 21 50.8,0; 22 53.34,0; 23 55.88,0; 24 58.42,0; 25 60.96,0; 26 63.5,0; 27 66.04,0; 28 68.58,0; 29 71.12,0; 30 73.66,0
MD80SGK = drill 0.9 pad 1.4: 1 -1.3,-1.9; 2 1.3,-1.9; 3 -3.4,-1.9; 4 -1.3,-4.4; 5 3.4,-1.9; 6 -3.4,-4.4; 7 0.9,-4.4; 8 3.4,-4.4 | drill 2.309 pad 3.463: 9 0,1.9; 10 -6.75,1.1; 11 6.75,1.1
1X06_NO_SILK = drill 1.016 pad 1.88: 1 0,0; 2 2.54,0; 3 5.08,0; 4 7.62,0; 5 10.16,0; 6 12.7,0
1X29_NO_SILK = drill 1.016 pad 1.88: 1 0,0; 2 2.54,0; 3 5.08,0; 4 7.62,0; 5 10.16,0; 6 12.7,0; 7 15.24,0; 8 17.78,0; 9 20.32,0; 10 22.86,0; 11 25.4,0; 12 27.94,0; 13 30.48,0; 14 33.02,0; 15 35.56,0; 16 38.1,0; 17 40.64,0; 18 43.18,0; 19 45.72,0; 20 48.26,0; 21 50.8,0; 22 53.34,0; 23 55.88,0; 24 58.42,0; 25 60.96,0; 26 63.5,0; 27 66.04,0; 28 68.58,0; 29 71.12,0
1X05_NO_SILK = drill 1.016 pad 1.88: 1 0,0; 2 2.54,0; 3 5.08,0; 4 7.62,0; 5 10.16,0
R0805 = smd 1.3 x 1.5: 1 -0.95,0; 2 0.95,0

### Placement (x,y rotation side)
C1  29.97,61.34 270 top
C2  39.37,61.34 90 top
C3  21.59,59.69 0 top
C4  34.92,55.88 0 top
C5  6.22,30.1 270 top
C6  21.59,38.1 0 top
C7  29.21,38.1 180 top
C8  6.35,76.2 90 top
D1  32.26,70.61 90 top
D2  37.34,69.34 0 top
IC1  10.16,39.37 90 top
IC2  25.4,27.94 0 top
IC3  25.4,48.9 0 top
IC4  34.8,63.25 0 top
J1  6.35,71.12 0 top
J2  6.35,64.77 0 top
J3  37.47,17.27 90 top
J4  5.08,17.27 0 top
J5  30.23,10.41 270 top
J6  37.47,12.19 0 top
J7  34.92,22.35 0 top
J8  34.92,27.43 0 top
J9  37.47,42.67 0 top
J10  60.96,2.03 90 top
J11  43.18,2.03 90 top
J12  63.5,2.03 90 top
J13  15.75,5.59 180 top
J14  45.72,2.03 0 top
J15  45.72,4.57 0 top
J16  45.72,7.11 0 top
J17  45.72,9.65 0 top
J18  45.72,12.19 0 top
J19  45.72,14.73 0 top
J20  45.72,17.27 0 top
J21  45.72,19.81 0 top
J22  45.72,22.35 0 top
J23  45.72,24.89 0 top
J24  45.72,27.43 0 top
J25  45.72,29.97 0 top
J26  45.72,32.51 0 top
J27  45.72,35.05 0 top
J28  45.72,37.59 0 top
J29  45.72,40.13 0 top
J30  45.72,42.67 0 top
J31  45.72,45.21 0 top
J32  45.72,47.75 0 top
J33  45.72,50.29 0 top
J34  45.72,52.83 0 top
J35  45.72,55.37 0 top
J36  45.72,57.91 0 top
J37  45.72,60.45 0 top
J38  45.72,62.99 0 top
J39  45.72,65.53 0 top
J40  45.72,68.07 0 top
J41  45.72,70.61 0 top
J42  45.72,73.15 0 top
J43  45.72,75.69 0 top
J46  66.04,7.11 0 top
J47  66.04,9.65 0 top
J48  66.04,12.19 0 top
J49  66.04,14.73 0 top
J50  66.04,17.27 0 top
J51  66.04,19.81 0 top
J52  66.04,22.35 0 top
J53  66.04,24.89 0 top
J54  66.04,27.43 0 top
J55  66.04,29.97 0 top
J56  66.04,32.51 0 top
J57  66.04,35.05 0 top
J58  66.04,37.59 0 top
J59  66.04,40.13 0 top
J60  66.04,42.67 0 top
J61  66.04,45.21 0 top
J62  66.04,47.75 0 top
J63  66.04,50.29 0 top
J64  66.04,52.83 0 top
J65  66.04,55.37 0 top
J66  66.04,57.91 0 top
J67  66.04,60.45 0 top
J68  66.04,62.99 0 top
J69  66.04,65.53 0 top
J70  66.04,68.07 0 top
J71  66.04,70.61 0 top
J72  66.04,73.15 0 top
J73  66.04,75.69 0 top
J74  81.28,7.11 90 top
J75  66.04,2.03 0 top
J76  66.04,4.57 0 top
R1  6.35,58.42 90 top
R2  8.89,58.42 90 top
R3  11.43,58.42 90 top
R4  13.97,58.42 90 top
R5  18.41,76.2 270 top
R6  22.23,76.2 270 top

### Tracks (layer width: path | path; a pad name or v marks a point on that pad's centre or on a via)
3.3V
  Top 0.305: 37.47,60.64 36.51,61.59 IC4.3 | 37.47,60.64 39.37,60.64 C2.1 | 30.16,55.88 32.7,55.88 | 32.7,55.88 C4.1 | 30.16,55.88 30.16,54.61 IC3.23 29.84,54.61 29.53,54.29 29.21,54.29 28.07,53.15 28.07,40.51 29.84,38.73 29.84,38.1 C7.1 30.16,34.92 | 30.16,55.88 IC3.24 | 32.7,55.88 37.47,60.64 | 30.16,34.92 30.16,33.66 IC2.23 29.84,33.66 29.78,33.59 27.94,33.59 26.04,31.69 26.04,22.48 29.46,19.05 31.75,19.05 33.53,17.27 J3.1 | 30.16,34.92 IC2.24
5V  (via drill 0.35)
  Top 0.305: C6.1 20.64,34.92 IC2.1 | C6.1 20.64,38.61 19.94,39.31 | C3.1 20.64,55.88 IC3.1 20.95,55.88 20.95,54.61 IC3.2 16.51,54.61 16.51,42.74 19.94,39.31 | C6.1 | J2.1 J1.1 C8.1 6.35,75.56 6.67,75.88 12.89,75.88 13.84,76.83 18.41,76.83 | 22.23,76.83 27.94,76.83 32.07,72.71 D1.A 32.07,72.39 30.42,72.39 30.42,65.6 26.67,61.85 26.67,46.04 19.94,39.31 | 18.41,76.83 R5.1 R6.1 22.23,76.83 | 22.23,76.83 18.41,76.83 | v5.08,32.77 6.22,31.62 C5.1 | v5.08,35.05 6.96,35.05 IC1.16
  Bottom 0.305: J2.1 3.05,61.47 3.05,35.05 | 3.05,35.05 3.05,32.77 | 3.05,32.77 3.05,17.78 3.56,17.27 J4.1 5.08,14.22 8.64,10.67 8.64,8.57 11.11,6.1 16,6.1 17.05,7.14 J13.1 18.69,5.84 19.81,5.84 21.05,7.08 25.63,7.08 28.96,10.41 J5.1 | v5.08,35.05 3.05,35.05 | 3.05,32.77 v5.08,32.77
GND  (via drill 0.35)
  Bottom 0.305: v4.83,44.2 v4.83,40.13
  pour Top: -2.54,83.82 41.4,83.82 41.4,0 -2.54,0
N$1
  Top 0.203: R3.2 11.43,61.28 13.97,63.82 J2.4 J1.4
N$3
  Top 0.305: 34.61,69.22 35.24,69.22 D2.C | 34.61,69.22 32.7,69.22 32.38,68.9 D1.C | 34.92,62.87 34.92,63.82 IC4.4 | 34.92,62.87 34.92,61.91 IC4.2 | 34.92,62.87 30.48,62.87 30.16,62.55 C1.1 | 34.92,62.87 IC4.4 | 34.61,69.22 34.61,64.14 IC4.4
N$4
  Top 0.203: R1.2 6.35,62.23 J2.2 J1.2
N$5
  Top 0.203: R2.2 8.89,61.28 11.43,63.82 J2.3 J1.3
N$6  (via drill 0.35)
  Top 0.203: 7.3,41.27 IC1.11 | v9.14,40.89 8.89,41.15 7.43,41.15
  Top 0.305: 7.43,41.15 7.3,41.27 | J4.2 8.64,16.26 8.64,8.64 11.43,5.84 12.8,5.84 J13.2
  Bottom 0.203: J4.2 9.14,18.8 v9.14,40.89
N$7
  Top 0.203: R4.2 16.51,61.91 J2.5 J1.5
N$8
  Top 0.203: R1.1 6.22,57.34 6.22,43.81 IC1.9
N$9  (via drill 0.35)
  Top 0.203: J2.7 J1.7 22.23,71.75 R6.2 | v23.37,45.72 IC3.9
  Bottom 0.203: J2.7 21.59,63.75 24.38,60.96 24.38,46.74 v23.37,45.72 23.37,20.32 J4.7
  Bottom 0.305: J4.7 18.03,14.99 15.49,14.99 13.58,13.07 13.58,11.26 J13.7
N$10  (via drill 0.35)
  Top 0.203: v10.16,31.62 10.16,34.04 9.14,35.05 9.14,36.32 8,37.47 IC1.14
  Top 0.305: J4.3 10.16,14.73 11.68,13.21 v15.49,13.21
  Bottom 0.203: J4.3 v10.16,31.62
  Bottom 0.305: v15.49,13.21 19.3,13.21 21.84,10.67 21.84,9.4 19.93,7.49 J13.3
N$11  (via drill 0.35)
  Top 0.203: v11.18,36.2 IC1.2 | J4.4 12.7,16.26 13.72,15.24 15.24,15.24 17.02,13.46 17.02,10.02 J13.4
  Bottom 0.203: J4.4 12.7,23.11 11.18,24.64 v11.18,36.2
N$12  (via drill 0.35)
  Top 0.203: v15.24,39.37 15.24,39.52 14.76,40.01 IC1.5
  Bottom 0.203: J4.5 v15.24,39.37
  Bottom 0.305: J13.5 11.59,7.49 10.41,8.66 10.41,11.68 15.24,16.51 J4.5
N$13
  Top 0.203: IC3.14 30.16,43.18 30.48,42.86 31.11,42.86 33.78,40.2 33.78,33.66 J3.6
N$14
  Top 0.203: IC3.15 30.16,44.45 30.23,44.39 31.62,44.39 34.92,41.08 34.92,35.05 J3.7
N$15
  Top 0.203: IC2.3 20.64,32.38 20.32,32.7 19.68,32.7 17.18,35.21 17.14,35.24 16.76,35.62 16.76,40.13 15.62,41.27 IC1.6
N$16
  Top 0.203: IC2.5 20.64,29.84 20.32,30.16 15.56,30.16 9.91,35.81 9.91,36.83 8,38.73 IC1.13
N$17
  Top 0.203: IC1.10 3.68,42.55 3.68,33.97 6.48,33.97 11.81,28.64 20.57,28.64 20.66,28.56 IC2.6
N$18  (via drill 0.35)
  Top 0.203: J1.6 18.41,71.75 R5.2 | v18.54,44.45 IC3.10
  Top 0.305: J4.6 17.78,16 19.15,14.63 J13.6
  Bottom 0.203: J1.6 J2.6 18.54,64.26 v18.54,44.45 18.54,18.22 17.78,17.46 J4.6
N$19
  Top 0.203: IC2.4 20.64,31.11 20.32,31.43 19.43,31.43 15.65,35.21 15.65,36.42 14.61,37.47 IC1.3
N$20
  Top 0.203: R3.1 11.18,57.22 11.18,38.73 IC1.4
N$21
  Top 0.203: R4.1 13.97,48.9 15.11,47.75 15.11,42.55 IC1.7
N$22
  Top 0.203: IC2.21 33.97,31.11 37.47,27.62 J3.5
N$23
  Top 0.203: IC2.20 31.63,29.84 33.43,28.05 33.43,26.29 34.82,24.89 J3.4
N$24
  Top 0.203: J3.3 37.45,22.35 35.7,24.11 34.06,24.11 32.77,25.4 32.77,26.92 31.11,28.57 IC2.19
N$25  (via drill 0.35)
  Top 0.203: IC1.1 13.97,34.19 v13.97,33.27 | J5.3 29.21,7.87 27.69,9.4 27.69,17.78 26.16,19.3 14.99,19.3 v13.97,20.32
  Bottom 0.203: v13.97,33.27 v13.97,20.32
N$27
  Top 0.203: IC2.7 21.95,27.3 24.56,24.69 24.56,22.16 34.52,12.2 34.52,9.39 33.01,7.87 J5.4
N$28
  Top 0.305: D2.A 39.37,69.22 39.37,66.99 40.89,65.47 40.89,46.1 J9.1
N$29  (via drill 0.35)
  Top 0.203: IC2.17 30,25.91 27.69,25.91 v27.43,25.65
  Bottom 0.203: v27.43,25.65 27.43,22.35 37.47,12.32 J6.1
N$30
  Top 0.762: J10.30 J10.29 J10.28 J10.27 J10.26 J10.25 J10.24 J10.23 J10.22 J10.21 J10.20 J10.19 J10.18 J10.17 J10.16 J10.15 J10.14 J10.13 J10.12 J10.11 J10.10 J10.9 J10.8 J10.7 J10.6 J10.5 J10.4 J10.3 J10.2 J10.1
N$31
  Top 0.762: J11.30 J11.29 J11.28 J11.27 J11.26 J11.25 J11.24 J11.23 J11.22 J11.21 J11.20 J11.19 J11.18 J11.17 J11.16 J11.15 J11.14 J11.13 J11.12 J11.11 J11.10 J11.9 J11.8 J11.7 J11.6 J11.5 J11.4 J11.3 J11.2 J11.1
N$32
  Top 0.762: J12.30 J12.29 J12.28 J12.27 J12.26 J12.25 J12.24 J12.23 J12.22 J12.21 J12.20 J12.19 J12.18 J12.17 J12.16 J12.15 J12.14 J12.13 J12.12 J12.11 J12.10 J12.9 J12.8 J12.7 J12.6 J12.5 J12.4 J12.3 J12.2 J12.1
N$33
  Top 0.203: R2.1 9.14,57.22 9.14,48.01 10.1,47.05 10.1,40.01 IC1.12
N$34
  Top 0.762: J14.1 45.72,2.22 48.26,2.22 J14.2 48.58,2.22 50.8,2.22 J14.3 51.12,2.22 53.34,2.22 J14.4 53.66,2.22 55.88,2.22 J14.5 56.2,2.22 58.42,2.22 J14.6
N$35
  Top 0.762: J29.1 45.72,40.32 48.26,40.32 J29.2 48.58,40.32 50.8,40.32 J29.3 51.12,40.32 53.34,40.32 J29.4 53.66,40.32 55.88,40.32 J29.5 56.2,40.32 58.42,40.32 J29.6
N$36
  Top 0.762: J15.1 45.72,4.76 48.26,4.76 J15.2 48.58,4.76 50.8,4.76 J15.3 51.12,4.76 53.34,4.76 J15.4 53.66,4.76 55.88,4.76 J15.5 56.2,4.76 58.42,4.76 J15.6
N$37
  Top 0.762: J30.1 45.72,42.86 48.26,42.86 J30.2 48.58,42.86 50.8,42.86 J30.3 51.12,42.86 53.34,42.86 J30.4 53.66,42.86 55.88,42.86 J30.5 56.2,42.86 58.42,42.86 J30.6
N$38
  Top 0.762: J31.1 45.72,45.4 48.26,45.4 J31.2 48.58,45.4 50.8,45.4 J31.3 51.12,45.4 53.34,45.4 J31.4 53.66,45.4 55.88,45.4 J31.5 56.2,45.4 58.42,45.4 J31.6
N$39
  Top 0.762: J16.1 45.72,7.3 48.26,7.3 J16.2 48.58,7.3 50.8,7.3 J16.3 51.12,7.3 53.34,7.3 J16.4 53.66,7.3 55.88,7.3 J16.5 56.2,7.3 58.42,7.3 J16.6
N$40
  Top 0.762: J17.1 45.72,9.84 48.26,9.84 J17.2 48.58,9.84 50.8,9.84 J17.3 51.12,9.84 53.34,9.84 J17.4 53.66,9.84 55.88,9.84 J17.5 56.2,9.84 58.42,9.84 J17.6
N$41
  Top 0.762: J32.1 45.72,47.94 48.26,47.94 J32.2 48.58,47.94 50.8,47.94 J32.3 51.12,47.94 53.34,47.94 J32.4 53.66,47.94 55.88,47.94 J32.5 56.2,47.94 58.42,47.94 J32.6
N$42
  Top 0.762: J33.1 45.72,50.48 48.26,50.48 J33.2 48.58,50.48 50.8,50.48 J33.3 51.12,50.48 53.34,50.48 J33.4 53.66,50.48 55.88,50.48 J33.5 56.2,50.48 58.42,50.48 J33.6
N$43
  Top 0.762: J18.1 45.72,12.38 48.26,12.38 J18.2 48.58,12.38 50.8,12.38 J18.3 51.12,12.38 53.34,12.38 J18.4 53.66,12.38 55.88,12.38 J18.5 56.2,12.38 58.42,12.38 J18.6
N$44
  Top 0.762: J19.1 45.72,14.92 48.26,14.92 J19.2 48.58,14.92 50.8,14.92 J19.3 51.12,14.92 53.34,14.92 J19.4 53.66,14.92 55.88,14.92 J19.5 56.2,14.92 58.42,14.92 J19.6
N$45
  Top 0.762: J20.1 45.72,17.46 48.26,17.46 J20.2 48.58,17.46 50.8,17.46 J20.3 51.12,17.46 53.34,17.46 J20.4 53.66,17.46 55.88,17.46 J20.5 56.2,17.46 58.42,17.46 J20.6
N$46
  Top 0.762: J21.1 45.72,20 48.26,20 J21.2 48.58,20 50.8,20 J21.3 51.12,20 53.34,20 J21.4 53.66,20 55.88,20 J21.5 56.2,20 58.42,20 J21.6
N$47
  Top 0.762: J22.1 45.72,22.54 48.26,22.54 J22.2 48.58,22.54 50.8,22.54 J22.3 51.12,22.54 53.34,22.54 J22.4 53.66,22.54 55.88,22.54 J22.5 56.2,22.54 58.42,22.54 J22.6
N$48
  Top 0.762: J23.1 45.72,25.08 48.26,25.08 J23.2 48.58,25.08 50.8,25.08 J23.3 51.12,25.08 53.34,25.08 J23.4 53.66,25.08 55.88,25.08 J23.5 56.2,25.08 58.42,25.08 J23.6
N$49
  Top 0.762: J24.1 45.72,27.62 48.26,27.62 J24.2 48.58,27.62 50.8,27.62 J24.3 51.12,27.62 53.34,27.62 J24.4 53.66,27.62 55.88,27.62 J24.5 56.2,27.62 58.42,27.62 J24.6
N$50
  Top 0.762: J25.1 45.72,30.16 48.26,30.16 J25.2 48.58,30.16 50.8,30.16 J25.3 51.12,30.16 53.34,30.16 J25.4 53.66,30.16 55.88,30.16 J25.5 56.2,30.16 58.42,30.16 J25.6
N$51
  Top 0.762: J26.1 45.72,32.7 48.26,32.7 J26.2 48.58,32.7 50.8,32.7 J26.3 51.12,32.7 53.34,32.7 J26.4 53.66,32.7 55.88,32.7 J26.5 56.2,32.7 58.42,32.7 J26.6
N$52
  Top 0.762: J27.1 45.72,35.24 48.26,35.24 J27.2 48.58,35.24 50.8,35.24 J27.3 51.12,35.24 53.34,35.24 J27.4 53.66,35.24 55.88,35.24 J27.5 56.2,35.24 58.42,35.24 J27.6
N$53
  Top 0.762: J28.1 45.72,37.78 48.26,37.78 J28.2 48.58,37.78 50.8,37.78 J28.3 51.12,37.78 53.34,37.78 J28.4 53.66,37.78 55.88,37.78 J28.5 56.2,37.78 58.42,37.78 J28.6
N$54
  Top 0.762: J34.1 45.72,53.02 48.26,53.02 J34.2 48.58,53.02 50.8,53.02 J34.3 51.12,53.02 53.34,53.02 J34.4 53.66,53.02 55.88,53.02 J34.5 56.2,53.02 58.42,53.02 J34.6
N$55
  Top 0.762: J35.1 45.72,55.56 48.26,55.56 J35.2 48.58,55.56 50.8,55.56 J35.3 51.12,55.56 53.34,55.56 J35.4 53.66,55.56 55.88,55.56 J35.5 56.2,55.56 58.42,55.56 J35.6
N$56
  Top 0.762: J36.1 45.72,58.1 48.26,58.1 J36.2 48.58,58.1 50.8,58.1 J36.3 51.12,58.1 53.34,58.1 J36.4 53.66,58.1 55.88,58.1 J36.5 56.2,58.1 58.42,58.1 J36.6
N$57
  Top 0.762: J37.1 45.72,60.64 48.26,60.64 J37.2 48.58,60.64 50.8,60.64 J37.3 51.12,60.64 53.34,60.64 J37.4 53.66,60.64 55.88,60.64 J37.5 56.2,60.64 58.42,60.64 J37.6
N$58
  Top 0.762: J38.1 45.72,63.18 48.26,63.18 J38.2 48.58,63.18 50.8,63.18 J38.3 51.12,63.18 53.34,63.18 J38.4 53.66,63.18 55.88,63.18 J38.5 56.2,63.18 58.42,63.18 J38.6
N$59
  Top 0.762: J39.1 45.72,65.72 48.26,65.72 J39.2 48.58,65.72 50.8,65.72 J39.3 51.12,65.72 53.34,65.72 J39.4 53.66,65.72 55.88,65.72 J39.5 56.2,65.72 58.42,65.72 J39.6
N$60
  Top 0.762: J40.1 45.72,68.26 48.26,68.26 J40.2 48.58,68.26 50.8,68.26 J40.3 51.12,68.26 53.34,68.26 J40.4 53.66,68.26 55.88,68.26 J40.5 56.2,68.26 58.42,68.26 J40.6
N$61
  Top 0.762: J41.1 45.72,70.8 48.26,70.8 J41.2 48.58,70.8 50.8,70.8 J41.3 51.12,70.8 53.34,70.8 J41.4 53.66,70.8 55.88,70.8 J41.5 56.2,70.8 58.42,70.8 J41.6
N$62
  Top 0.762: J42.1 45.72,73.34 48.26,73.34 J42.2 48.58,73.34 50.8,73.34 J42.3 51.12,73.34 53.34,73.34 J42.4 53.66,73.34 55.88,73.34 J42.5 56.2,73.34 58.42,73.34 J42.6
N$63
  Top 0.762: J43.1 45.72,75.88 48.26,75.88 J43.2 48.58,75.88 50.8,75.88 J43.3 51.12,75.88 53.34,75.88 J43.4 53.66,75.88 55.88,75.88 J43.5 56.2,75.88 58.42,75.88 J43.6
N$64
  Top 0.762: J75.1 66.04,2.22 68.58,2.22 J75.2 68.9,2.22 71.12,2.22 J75.3 71.44,2.22 73.66,2.22 J75.4 73.98,2.22 76.2,2.22 J75.5
N$65
  Top 0.762: J76.1 66.04,4.76 68.58,4.76 J76.2 68.9,4.76 71.12,4.76 J76.3 71.44,4.76 73.66,4.76 J76.4 73.98,4.76 76.2,4.76 J76.5
N$66
  Top 0.762: J46.1 66.04,7.3 68.58,7.3 J46.2 68.9,7.3 71.12,7.3 J46.3 71.44,7.3 73.66,7.3 J46.4 73.98,7.3 76.2,7.3 J46.5 76.52,7.3 78.74,7.3 J46.6
N$67
  Top 0.762: J47.1 66.04,9.84 68.58,9.84 J47.2 68.9,9.84 71.12,9.84 J47.3 71.44,9.84 73.66,9.84 J47.4 73.98,9.84 76.2,9.84 J47.5 76.52,9.84 78.74,9.84 J47.6
N$68
  Top 0.762: J48.1 66.04,12.38 68.58,12.38 J48.2 68.9,12.38 71.12,12.38 J48.3 71.44,12.38 73.66,12.38 J48.4 73.98,12.38 76.2,12.38 J48.5 76.52,12.38 78.74,12.38 J48.6
N$69
  Top 0.762: J49.1 66.04,14.92 68.58,14.92 J49.2 68.9,14.92 71.12,14.92 J49.3 71.44,14.92 73.66,14.92 J49.4 73.98,14.92 76.2,14.92 J49.5 76.52,14.92 78.74,14.92 J49.6
N$70
  Top 0.762: J50.1 66.04,17.46 68.58,17.46 J50.2 68.9,17.46 71.12,17.46 J50.3 71.44,17.46 73.66,17.46 J50.4 73.98,17.46 76.2,17.46 J50.5 76.52,17.46 78.74,17.46 J50.6
N$71
  Top 0.762: J51.1 66.04,20 68.58,20 J51.2 68.9,20 71.12,20 J51.3 71.44,20 73.66,20 J51.4 73.98,20 76.2,20 J51.5 76.52,20 78.74,20 J51.6
N$72
  Top 0.762: J52.1 66.04,22.54 68.58,22.54 J52.2 68.9,22.54 71.12,22.54 J52.3 71.44,22.54 73.66,22.54 J52.4 73.98,22.54 76.2,22.54 J52.5 76.52,22.54 78.74,22.54 J52.6
N$73
  Top 0.762: J53.1 66.04,25.08 68.58,25.08 J53.2 68.9,25.08 71.12,25.08 J53.3 71.44,25.08 73.66,25.08 J53.4 73.98,25.08 76.2,25.08 J53.5 76.52,25.08 78.74,25.08 J53.6
N$74
  Top 0.762: J54.1 66.04,27.62 68.58,27.62 J54.2 68.9,27.62 71.12,27.62 J54.3 71.44,27.62 73.66,27.62 J54.4 73.98,27.62 76.2,27.62 J54.5 76.52,27.62 78.74,27.62 J54.6
N$75
  Top 0.762: J55.1 66.04,30.16 68.58,30.16 J55.2 68.9,30.16 71.12,30.16 J55.3 71.44,30.16 73.66,30.16 J55.4 73.98,30.16 76.2,30.16 J55.5 76.52,30.16 78.74,30.16 J55.6
N$76
  Top 0.762: J56.1 66.04,32.7 68.58,32.7 J56.2 68.9,32.7 71.12,32.7 J56.3 71.44,32.7 73.66,32.7 J56.4 73.98,32.7 76.2,32.7 J56.5 76.52,32.7 78.74,32.7 J56.6
N$77
  Top 0.762: J57.1 66.04,35.24 68.58,35.24 J57.2 68.9,35.24 71.12,35.24 J57.3 71.44,35.24 73.66,35.24 J57.4 73.98,35.24 76.2,35.24 J57.5 76.52,35.24 78.74,35.24 J57.6
N$78
  Top 0.762: J58.1 66.04,37.78 68.58,37.78 J58.2 68.9,37.78 71.12,37.78 J58.3 71.44,37.78 73.66,37.78 J58.4 73.98,37.78 76.2,37.78 J58.5 76.52,37.78 78.74,37.78 J58.6
N$79
  Top 0.762: J59.1 66.04,40.32 68.58,40.32 J59.2 68.9,40.32 71.12,40.32 J59.3 71.44,40.32 73.66,40.32 J59.4 73.98,40.32 76.2,40.32 J59.5 76.52,40.32 78.74,40.32 J59.6
N$80
  Top 0.762: J60.1 66.04,42.86 68.58,42.86 J60.2 68.9,42.86 71.12,42.86 J60.3 71.44,42.86 73.66,42.86 J60.4 73.98,42.86 76.2,42.86 J60.5 76.52,42.86 78.74,42.86 J60.6
N$81
  Top 0.762: J61.1 66.04,45.4 68.58,45.4 J61.2 68.9,45.4 71.12,45.4 J61.3 71.44,45.4 73.66,45.4 J61.4 73.98,45.4 76.2,45.4 J61.5 76.52,45.4 78.74,45.4 J61.6
N$82
  Top 0.762: J62.1 66.04,47.94 68.58,47.94 J62.2 68.9,47.94 71.12,47.94 J62.3 71.44,47.94 73.66,47.94 J62.4 73.98,47.94 76.2,47.94 J62.5 76.52,47.94 78.74,47.94 J62.6
N$83
  Top 0.762: J63.1 66.04,50.48 68.58,50.48 J63.2 68.9,50.48 71.12,50.48 J63.3 71.44,50.48 73.66,50.48 J63.4 73.98,50.48 76.2,50.48 J63.5 76.52,50.48 78.74,50.48 J63.6
N$84
  Top 0.762: J64.1 66.04,53.02 68.58,53.02 J64.2 68.9,53.02 71.12,53.02 J64.3 71.44,53.02 73.66,53.02 J64.4 73.98,53.02 76.2,53.02 J64.5 76.52,53.02 78.74,53.02 J64.6
N$85
  Top 0.762: J65.1 66.04,55.56 68.58,55.56 J65.2 68.9,55.56 71.12,55.56 J65.3 71.44,55.56 73.66,55.56 J65.4 73.98,55.56 76.2,55.56 J65.5 76.52,55.56 78.74,55.56 J65.6
N$86
  Top 0.762: J66.1 66.04,58.1 68.58,58.1 J66.2 68.9,58.1 71.12,58.1 J66.3 71.44,58.1 73.66,58.1 J66.4 73.98,58.1 76.2,58.1 J66.5 76.52,58.1 78.74,58.1 J66.6
N$87
  Top 0.762: J67.1 66.04,60.64 68.58,60.64 J67.2 68.9,60.64 71.12,60.64 J67.3 71.44,60.64 73.66,60.64 J67.4 73.98,60.64 76.2,60.64 J67.5 76.52,60.64 78.74,60.64 J67.6
N$88
  Top 0.762: J68.1 66.04,63.18 68.58,63.18 J68.2 68.9,63.18 71.12,63.18 J68.3 71.44,63.18 73.66,63.18 J68.4 73.98,63.18 76.2,63.18 J68.5 76.52,63.18 78.74,63.18 J68.6
N$89
  Top 0.762: J69.1 66.04,65.72 68.58,65.72 J69.2 68.9,65.72 71.12,65.72 J69.3 71.44,65.72 73.66,65.72 J69.4 73.98,65.72 76.2,65.72 J69.5 76.52,65.72 78.74,65.72 J69.6
N$90
  Top 0.762: J70.1 66.04,68.26 68.58,68.26 J70.2 68.9,68.26 71.12,68.26 J70.3 71.44,68.26 73.66,68.26 J70.4 73.98,68.26 76.2,68.26 J70.5 76.52,68.26 78.74,68.26 J70.6
N$91
  Top 0.762: J71.1 66.04,70.8 68.58,70.8 J71.2 68.9,70.8 71.12,70.8 J71.3 71.44,70.8 73.66,70.8 J71.4 73.98,70.8 76.2,70.8 J71.5 76.52,70.8 78.74,70.8 J71.6
N$92
  Top 0.762: J72.1 66.04,73.34 68.58,73.34 J72.2 68.9,73.34 71.12,73.34 J72.3 71.44,73.34 73.66,73.34 J72.4 73.98,73.34 76.2,73.34 J72.5 76.52,73.34 78.74,73.34 J72.6
N$93
  Top 0.762: J73.1 66.04,75.88 68.58,75.88 J73.2 68.9,75.88 71.12,75.88 J73.3 71.44,75.88 73.66,75.88 J73.4 73.98,75.88 76.2,75.88 J73.5 76.52,75.88 78.74,75.88 J73.6
N$94
  Top 0.762: J74.29 J74.28 J74.27 J74.26 J74.25 J74.24 J74.23 J74.22 J74.21 J74.20 J74.19 J74.18 J74.17 J74.16 J74.15 J74.14 J74.13 J74.12 J74.11 J74.10 J74.9 J74.8 J74.7 J74.6 J74.5 J74.4 J74.3 J74.2 J74.1
N$97
  Top 0.203: IC2.18 30.16,27.3 30.23,27.24 31.05,27.24 32.13,26.16 32.13,21.72 34.04,19.81 J3.2

### Text on the board
tPlace: PC Engine Joypad | Breakout Board v. 3 | (c) David Shadoff, 2019 | +5V | D0 | D1 | D2 | D3 | SEL | CLR | Gnd | Gnd | Gnd | Gnd | CLR | SEL | D3 | D2 | D1 | D0 | +3.3V | +5V | D0 | D1 | D2 | D3 | SEL | CLR | Gnd | Gnd | Proto | Only | Toggle | PCE | Only
tValues: 1 | 1